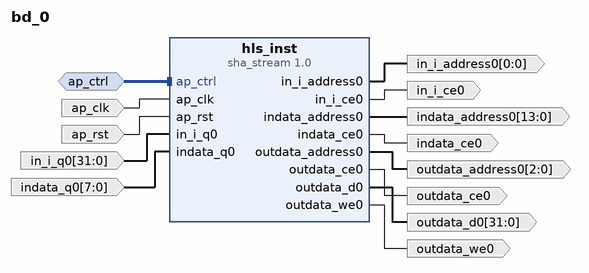
[diagram p0: block diagram of the top level]
# Vivado block design bd_0, xcu50-fsvh2104-2-e, Vivado 2023.2
create_bd_design bd_0

create_bd_intf_port -mode Slave -vlnv xilinx.com:interface:acc_handshake_rtl:1.0 ap_ctrl
create_bd_port -dir I -type clk ap_clk
set_property -dict {CONFIG.FREQ_HZ 125000000.0} [get_bd_ports ap_clk]
create_bd_port -dir I -type rst ap_rst
set_property -dict {CONFIG.POLARITY ACTIVE_HIGH} [get_bd_ports ap_rst]
create_bd_port -dir O -from 0 -to 0 -type data in_i_address0
create_bd_port -dir O in_i_ce0
create_bd_port -dir I -from 31 -to 0 -type data in_i_q0
create_bd_port -dir O -from 13 -to 0 -type data indata_address0
create_bd_port -dir O indata_ce0
create_bd_port -dir I -from 7 -to 0 -type data indata_q0
create_bd_port -dir O -from 2 -to 0 -type data outdata_address0
create_bd_port -dir O outdata_ce0
create_bd_port -dir O -from 31 -to 0 -type data outdata_d0
create_bd_port -dir O outdata_we0

create_bd_cell -type ip -vlnv xilinx.com:hls:sha_stream:1.0 hls_inst

# ---- connections ----

connect_bd_intf_net -intf_net ap_ctrl_0_1 [get_bd_intf_ports ap_ctrl] [get_bd_intf_pins hls_inst/ap_ctrl]
connect_bd_net -net ap_clk_0_1 [get_bd_ports ap_clk] [get_bd_pins hls_inst/ap_clk]
connect_bd_net -net ap_rst_0_1 [get_bd_ports ap_rst] [get_bd_pins hls_inst/ap_rst]
connect_bd_net [get_bd_pins hls_inst/in_i_address0] [get_bd_ports in_i_address0]
connect_bd_net [get_bd_pins hls_inst/in_i_ce0] [get_bd_ports in_i_ce0]
connect_bd_net [get_bd_pins hls_inst/indata_address0] [get_bd_ports indata_address0]
connect_bd_net [get_bd_pins hls_inst/indata_ce0] [get_bd_ports indata_ce0]
connect_bd_net [get_bd_pins hls_inst/outdata_address0] [get_bd_ports outdata_address0]
connect_bd_net [get_bd_pins hls_inst/outdata_ce0] [get_bd_ports outdata_ce0]
connect_bd_net [get_bd_pins hls_inst/outdata_d0] [get_bd_ports outdata_d0]
connect_bd_net [get_bd_pins hls_inst/outdata_we0] [get_bd_ports outdata_we0]
connect_bd_net -net in_i_q0_0_1 [get_bd_ports in_i_q0] [get_bd_pins hls_inst/in_i_q0]
connect_bd_net -net indata_q0_0_1 [get_bd_ports indata_q0] [get_bd_pins hls_inst/indata_q0]

validate_bd_design
save_bd_design
